# EAGLE design with_usb_small_smd_jmp (EAGLE 8.3.2)
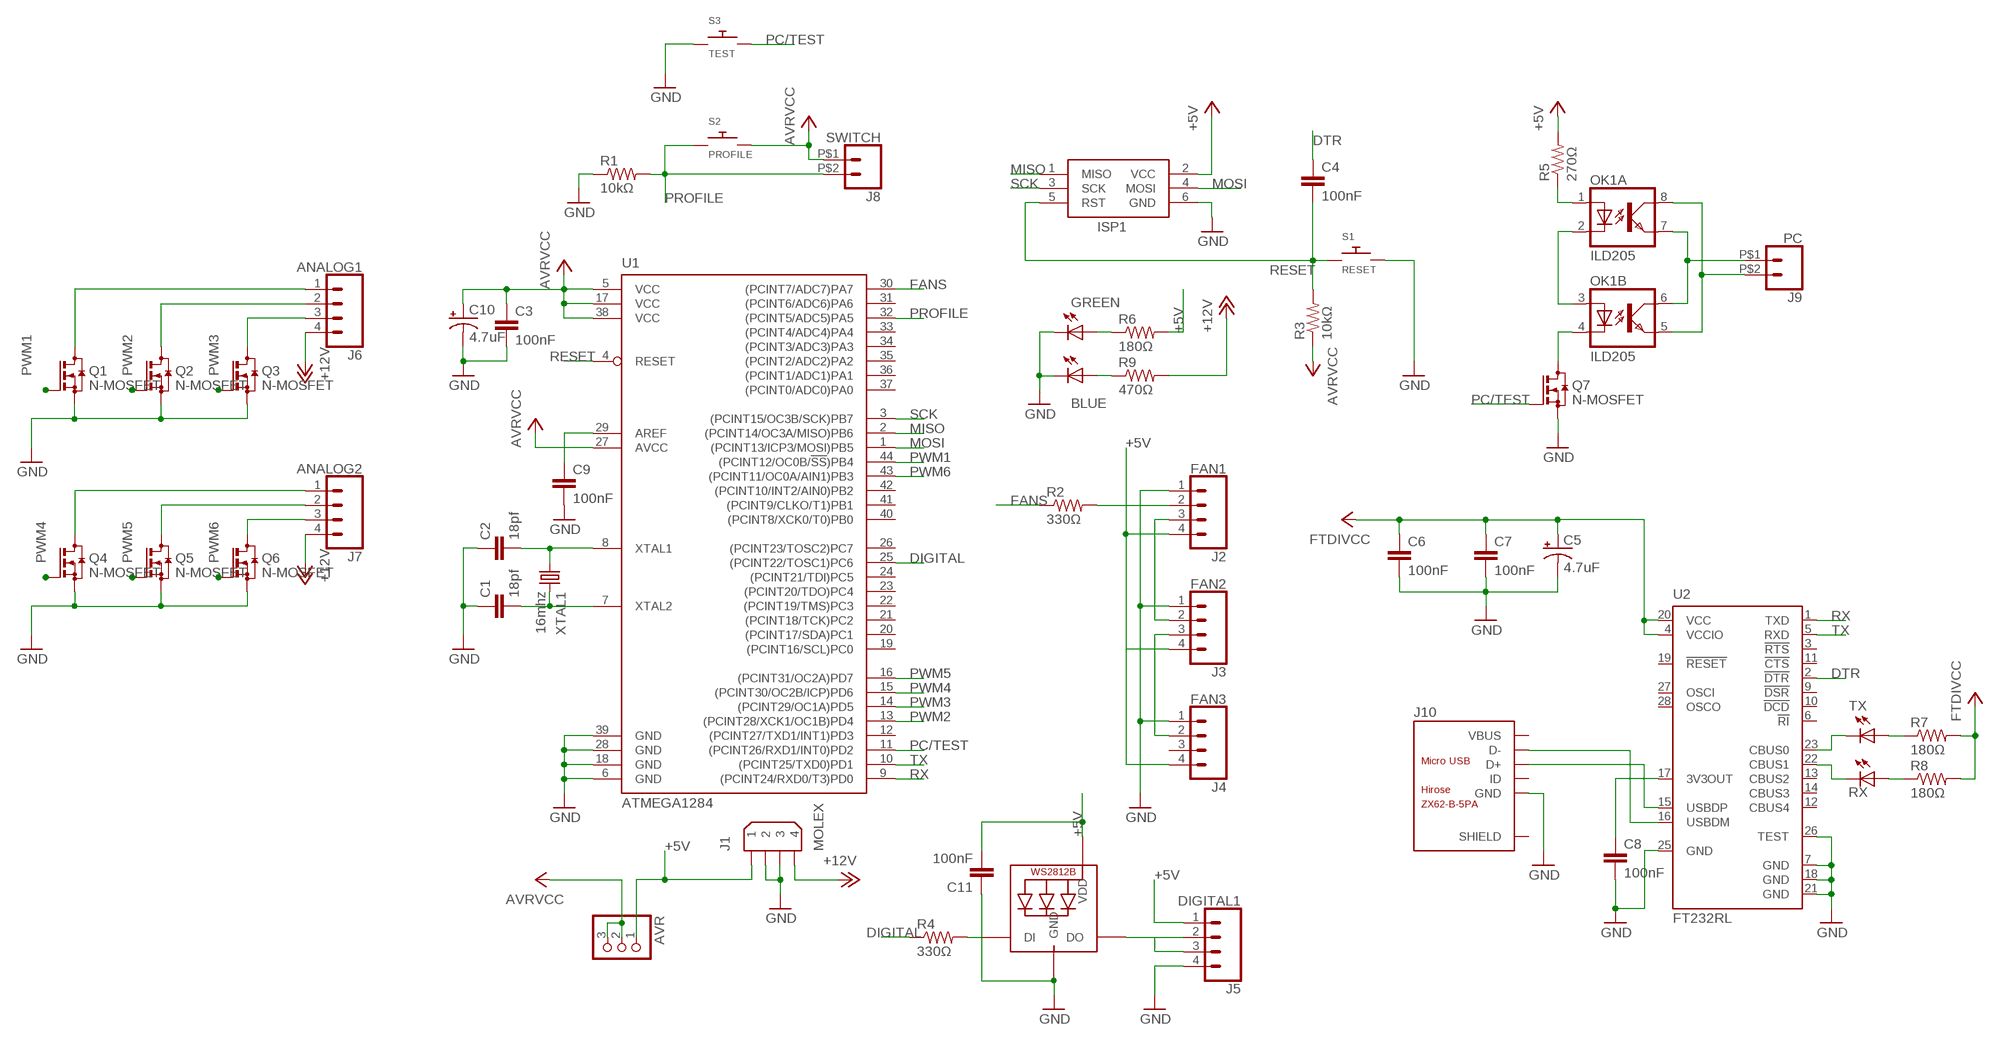
[diagram p0: schematic, sheet 1]

## Parts
AVR  PINHD-1X3  [1X03]
C1  18pf  C-EUC0805  [C0805]
C2  18pf  C-EUC0805  [C0805]
C3  100nF  C-EUC0805  [C0805]
C4  100nF  C-EUC0805  [C0805]
C5  4.7uF  CPOL-US153CLV-0405  [153CLV-0405]
C6  100nF  C-EUC0805  [C0805]
C7  100nF  C-EUC0805  [C0805]
C8  100nF  C-EUC0805  [C0805]
C9  100nF  C-EUC0805  [C0805]
C10  4.7uF  CPOL-US153CLV-0405  [153CLV-0405]
C11  100nF  C-EUC0805  [C0805]
ISP1  AVRISP-6  [AVRISP]
J1  MOLEX  9090-4R  [9090-4R]
J2  FAN1  TJC8-4P  [TJC8-4P]
J3  FAN2  TJC8-4P  [TJC8-4P]
J4  FAN3  TJC8-4P  [TJC8-4P]
J5  DIGITAL1  MX-22-05-3041  [MX-22-05-3041]
J6  ANALOG1  MX-22-05-3041  [MX-22-05-3041]
J7  ANALOG2  MX-22-05-3041  [MX-22-05-3041]
J8  SWITCH  MX-7395-02BG  [MX-7395-02BG]
J9  PC  MX-7395-02BG  [MX-7395-02BG]
J10  MICRO_USB  [MICRO_USB]
LED1  TX  LEDSML0805  [SML0805]
LED2  RX  LEDSML0805  [SML0805]
LED3  GREEN  LEDSML0805  [SML0805]
LED4  BLUE  LEDSML0805  [SML0805]
OK1  ILD205  [SOIC08]
Q1  N-MOSFET  [SOT23]
Q2  N-MOSFET  [SOT23]
Q3  N-MOSFET  [SOT23]
Q4  N-MOSFET  [SOT23]
Q5  N-MOSFET  [SOT23]
Q6  N-MOSFET  [SOT23]
Q7  N-MOSFET  [SOT23]
R1  10kΩ  R-US_R0805  [R0805]
R2  330Ω  R-US_R0805  [R0805]
R3  10kΩ  R-US_R0805  [R0805]
R4  330Ω  R-US_R0805  [R0805]
R5  270Ω  R-US_R0805  [R0805]
R6  180Ω  R-US_R0805  [R0805]
R7  180Ω  R-US_R0805  [R0805]
R8  180Ω  R-US_R0805  [R0805]
R9  470Ω  R-US_R0805  [R0805]
RGB  WS2812B  [WS2812B]
S1  RESET  BUTTON  [B3F-1000]
S2  PROFILE  BUTTON  [B3F-1000]
S3  TEST  BUTTON  [B3F-1000]
U1  ATMEGA1284  ATMEGA1284P-AU  [TQFP44]
U2  FT232RL  [SSOP28]
XTAL1  16mhz  CRYSTALHC49U-V  [HC49U-V]

## Nets
+3V3: C8.1 U2.17(3V3OUT)
+5V: AVR.1 C5.+ C6.1 C7.1 C11.2 J1.1 J2.4 J3.4 J4.4 J5.1 R5.2 R6.2 R7.2 R8.2 RGB.1-VDD(VDD) U2.4(VCCIO) U2.20(VCC) ; supply symbol labelled FTDIVCC
+12V: J1.4 J6.4 J7.4 R9.2
AVR: AVR.2 AVR.3 C3.1 C10.+ ISP1.2(VCC) J8.P$1 R3.1 S2.3 S2.4 U1.5(VCC) U1.17(VCC) U1.27(AVCC) U1.38(VCC) ; supply symbol labelled AVRVCC, +5V
D+: J10.3(D+) U2.15(USBDP)
D-: J10.2(D-) U2.16(USBDM)
DIGITAL: R4.1 U1.25((PCINT22/TOSC1)PC6)
DIN-D: J5.2 J5.3 RGB.2-DOUT(DO)
DTR: C4.1 U2.2(!DTR)
F1-DIN: J2.2 R2.2
F2-DIN: J2.3 J3.2
F3-DIN: J3.3 J4.2
FANS: R2.1 U1.30((PCINT7/ADC7)PA7)
GND: C1.1 C2.1 C3.2 C5.- C6.2 C7.2 C8.2 C9.2 C10.- C11.1 ISP1.6(GND) J1.2 J1.3 J2.1 J3.1 J4.1 J5.4 J10.5(GND) LED3.C LED4.C Q1.2(S) Q2.2(S) Q3.2(S) Q4.2(S) Q5.2(S) Q6.2(S) Q7.2(S) R1.1 RGB.3-GND(GND) S1.3 S1.4 S3.1 S3.2 U1.6(GND) U1.18(GND) U1.28(GND) U1.39(GND) U2.7(GND) U2.18(GND) U2.21(GND) U2.25(GND) U2.26(TEST)
LED-IN: R4.2 RGB.4-DIN(DI)
MISO: ISP1.1(MISO) U1.2((PCINT14/OC3A/MISO)PB6)
MOSI: ISP1.4(MOSI) U1.1((PCINT13/ICP3/MOSI)PB5)
N$2: LED1.A R7.1
N$4: LED2.A R8.1
N$5: LED4.A R9.1
N$6: C9.1 U1.29(AREF)
N$7: LED3.A R6.1
N$8: OK1.1(A:A) R5.1
N$11: OK1.2(A:C) OK1.3(B:A)
N$13: OK1.4(B:C) Q7.3(D)
PC1: J9.P$2 OK1.5(B:EMIT) OK1.8(A:COL)
PC2: J9.P$1 OK1.6(B:COL) OK1.7(A:EMIT)
PC/TEST: Q7.1(G) S3.3 S3.4 U1.11((PCINT26/RXD1/INT0)PD2)
PROFILE: J8.P$2 R1.2 S2.1 S2.2 U1.32((PCINT5/ADC5)PA5)
PWM1: Q1.1(G) U1.44((PCINT12/OC0B/!SS!)PB4)
PWM2: Q2.1(G) U1.13((PCINT28/XCK1/OC1B)PD4)
PWM3: Q3.1(G) U1.14((PCINT29/OC1A)PD5)
PWM4: Q4.1(G) U1.15((PCINT30/OC2B/ICP)PD6)
PWM5: Q5.1(G) U1.16((PCINT31/OC2A)PD7)
PWM6: Q6.1(G) U1.43((PCINT11/OC0A/AIN1)PB3)
RESET: C4.2 ISP1.5(RST) R3.2 S1.1 S1.2 U1.4(RESET)
RX: U1.9((PCINT24/RXD0/T3)PD0) U2.1(TXD)
RXLED: LED2.C U2.22(CBUS1)
S1-1: J6.1 Q1.3(D)
S1-2: J6.2 Q2.3(D)
S1-3: J6.3 Q3.3(D)
S2-1: J7.1 Q4.3(D)
S2-2: J7.2 Q5.3(D)
S2-3: J7.3 Q6.3(D)
SCK: ISP1.3(SCK) U1.3((PCINT15/OC3B/SCK)PB7)
TX: U1.10((PCINT25/TXD0)PD1) U2.5(RXD)
TXLED: LED1.C U2.23(CBUS0)
XTAL1: C2.2 U1.8(XTAL1) XTAL1.1
XTAL2: C1.2 U1.7(XTAL2) XTAL1.2
Unconnected: J4.3 J10.1(VBUS) J10.4(ID) J10.S1(SHIELD) J10.S2(SHIELD) J10.S3(SHIELD) J10.S4(SHIELD) J10.S5(SHIELD) J10.S6(SHIELD) U1.12((PCINT27/TXD1/INT1)PD3) U1.19((PCINT16/SCL)PC0) U1.20((PCINT17/SDA)PC1) U1.21((PCINT18/TCK)PC2) U1.22((PCINT19/TMS)PC3) U1.23((PCINT20/TDO)PC4) U1.24((PCINT21/TDI)PC5) U1.26((PCINT23/TOSC2)PC7) U1.31((PCINT6/ADC6)PA6) U1.33((PCINT4/ADC4)PA4) U1.34((PCINT3/ADC3)PA3) U1.35((PCINT2/ADC2)PA2) U1.36((PCINT1/ADC1)PA1) U1.37((PCINT0/ADC0)PA0) U1.40((PCINT8/XCK0/T0)PB0) U1.41((PCINT9/CLKO/T1)PB1) U1.42((PCINT10/INT2/AIN0)PB2) U2.3(!RTS) U2.6(!RI) U2.9(!DSR) U2.10(!DCD) U2.11(!CTS) U2.12(CBUS4) U2.13(CBUS2) U2.14(CBUS3) U2.19(!RESET) U2.27(OSCI) U2.28(OSCO)

## Library data of the parts
AVR = my_parts:PINHD-1X3: PIN HEADER
C1 C4 = rcl:C-EU: CAPACITOR, European symbol
C2 C3 C6-C9 C11 = resistor:C-EU: CAPACITOR, European symbol
C5 C10 = resistor:CPOL-US: POLARIZED CAPACITOR, American symbol
ISP1 = my_parts:AVRISP: AVR ISP HEADER Standard 6 pin header for AVR programming
J1 = con-thomas-betts:9090-4: Disk Drive Power four position Source: Thomas & Betts Electronic Interconnects Eiropean Edition 1998; OC_FARNELL: unknown; OC_NEWARK: unknown
J2-J4 = my_parts:TJC8-4P
J5-J7 = my_parts:MX-22-05-3041
J8 J9 = my_parts:MX-7395-02BG
J10 = my_parts:MICRO_USB
LED1-LED4 = led:LED: LED OSRAM: - CHIPLED LG R971, LG N971, LY N971, LG Q971, LY Q971, LO R971, LY R971 LH N974, LH R974 LS Q976, LO Q976, LY Q976 LO Q996 - Hyper CHIPLED LW Q18S LB Q993, LB Q99A, LB R99A - SideLED LS A670, LO A670, LY A670, LG A670, LP A670 LB A673, LV A673, LT A673, LW A673 LH A674 LY A675 LS A676, LA A676, LO A676, LY A676, LW A676 LS A679, LY A679, LG A679 - Hyper Micro SIDELED® LS Y876, LA Y876, LO Y876, LY Y876 LT Y87S - SmartLED LW L88C, LW L88S LB L89C, LB L89S, LG L890 LS L89K, LO L89K, LY L89K LS L896, LA L896, LO L896, LY L896 - TOPLED LS T670, LO T670, LY T670, LG T670, LP T670 LSG T670, LSP T670, LSY T670, LOP T670, LYG T670 LG T671, LOG T671, LSG T671 LB T673, LV T673, LT T673, LW T673 LH T674 LS T676, LA T676, LO T676, LY T676, LB T676, LH T676, LSB T676, LW T676 LB T67C, LV T67C, LT T67C, LS T67K, LO T67K, LY T67K, LW E67C LS E67B, LA E67B, LO E67B, LY E67B, LB E67C, LV E67C, LT E67C LW T67C LS T679, LY T679, LG T679 LS T770, LO T770, LY T770, LG T770, LP T770 LB T773, LV T773, LT T773, LW T773 LH T774 LS E675, LA E675, LY E675, LS T675 LS T776, LA T776, LO T776, LY T776, LB T776 LHGB T686 LT T68C, LB T68C - Hyper Mini TOPLED® LB M676 - Mini TOPLED Santana® LG M470 LS M47K, LO M47K, LY M47K Source: http://www.osram.convergy.de LUXEON: - LUMILED® LXK2-PW12-R00, LXK2-PW12-S00, LXK2-PW14-U00, LXK2-PW14-V00 LXK2-PM12-R00, LXK2-PM12-S00, LXK2-PM14-U00 LXK2-PE12-Q00, LXK2-PE12-R00, LXK2-PE12-S00, LXK2-PE14-T00, LXK2-PE14-U00 LXK2-PB12-K00, LXK2-PB12-L00, LXK2-PB12-M00, LXK2-PB14-N00, LXK2-PB14-P00, LXK2-PB14-Q00 LXK2-PR12-L00, LXK2-PR12-M00, LXK2-PR14-Q00, LXK2-PR14-R00 LXK2-PD12-Q00, LXK2-PD12-R00, LXK2-PD12-S00 LXK2-PH12-R00, LXK2-PH12-S00 LXK2-PL12-P00, LXK2-PL12-Q00, LXK2-PL12-R00 Source: www.luxeon.com KINGBRIGHT: KA-3528ASYC Source: www.kingbright.com
OK1 = optocoupler:ILD2*: Siemens ILD205/206/207/211/213/217 DUAL PHOTOTRANSISTOR SMALL OUTLINE SURFACE MOUNT OPTOCOUPLER Source: 153385-da-01-en-Optocoupler_ILD205-T.pdf; MF: VISHAY/TELEFUNKEN; MPN: ILD205T; OC_FARNELL: 1469512; OC_NEWARK: 20H8678
Q1-Q7 = my_parts:N-MOSFET
R1-R9 = resistor:R-US_: RESISTOR, American symbol
RGB = my_parts:WS2812B
S1-S3 = my_parts:BUTTON
U1 = my_parts:ATMEGA1284P-AU
U2 = ftdichip:FT232R: Source: http://www.ftdichip.com/Documents/DataSheets/DS_FT232R_v104.pdf; MPN: FT232RL; OC_FARNELL: 1146032; OC_NEWARK: 91K9918
XTAL1 = adafruit:CRYSTAL: CRYSTAL; OC_FARNELL: 1666969; OC_NEWARK: unknown

## Net classes
0 default: clearance 0.152 mm
1 GND: clearance 0.61 mm

## Board
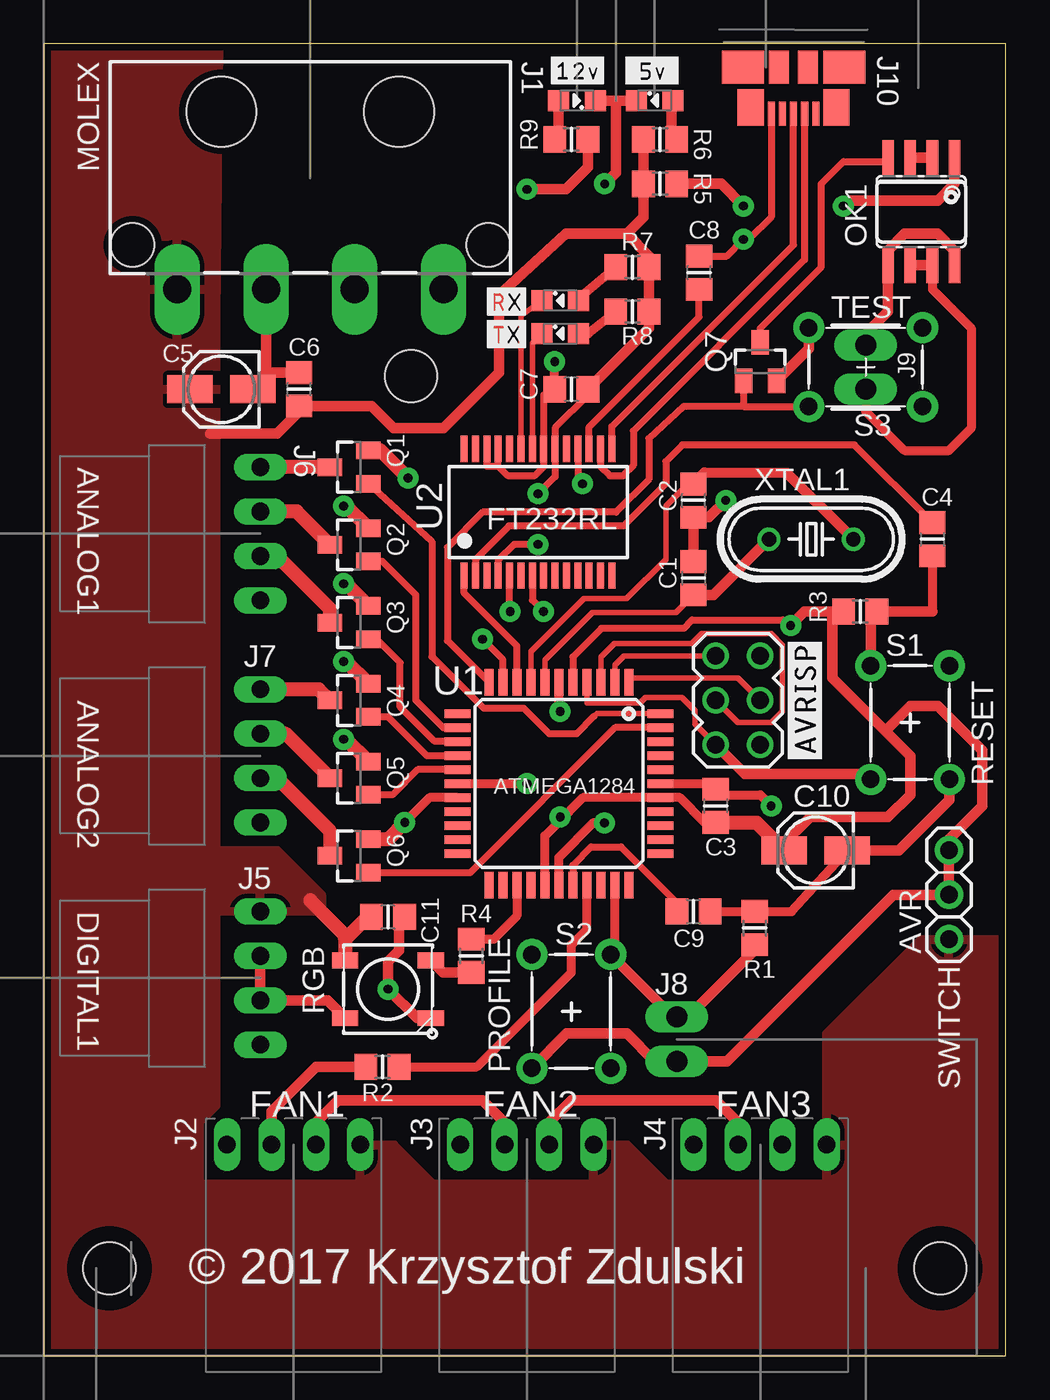
[diagram p1: board, top side]
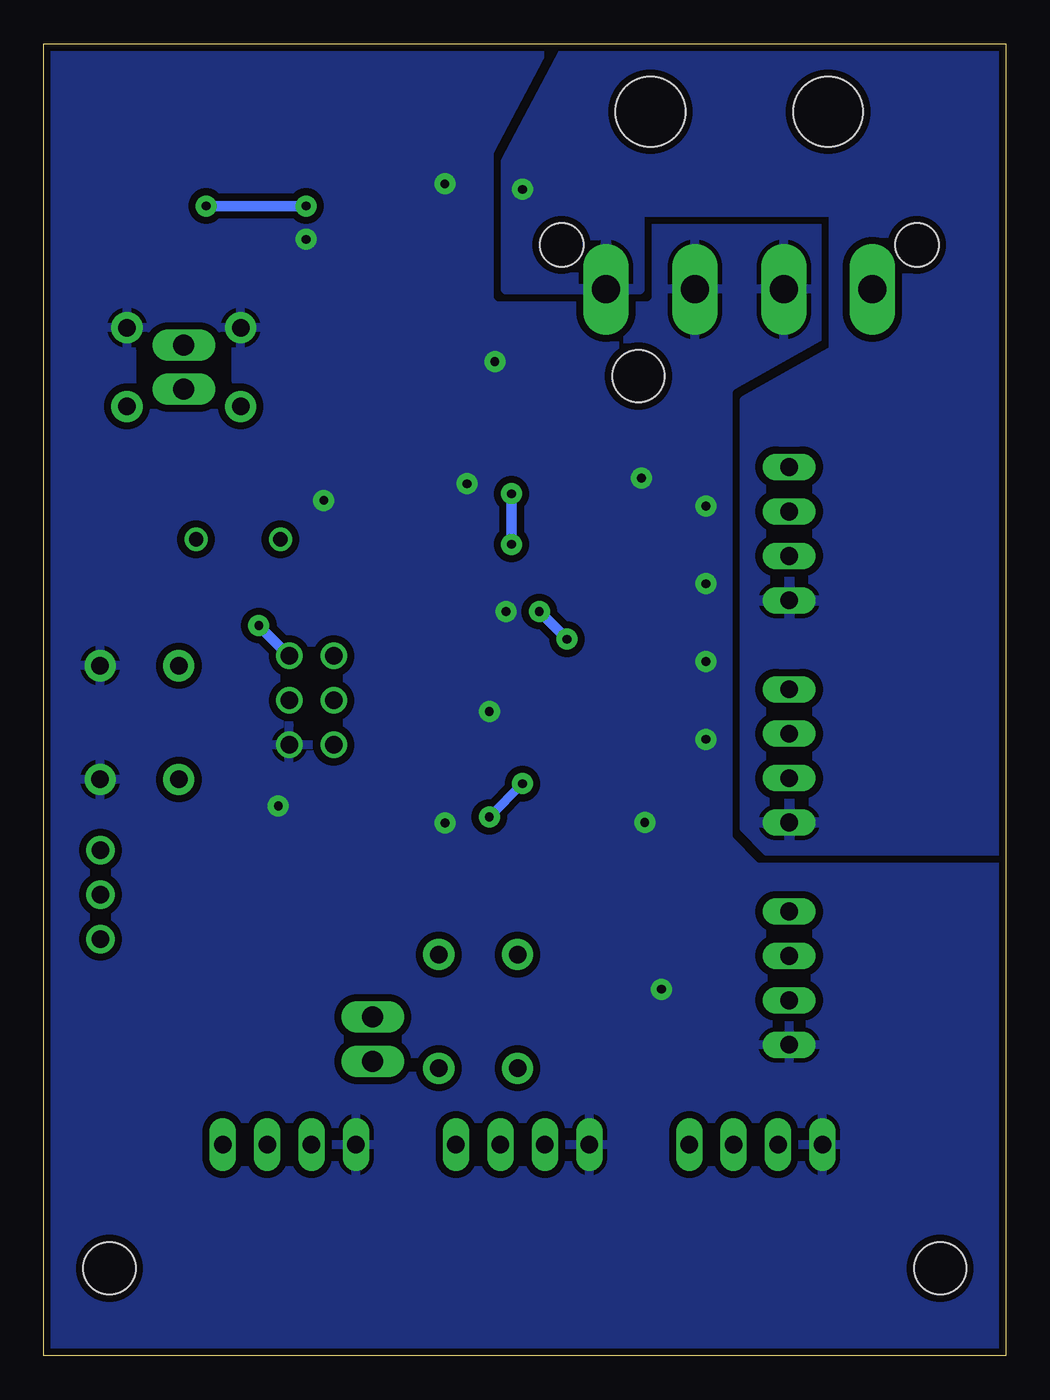
[diagram p2: board, bottom side, seen from below]

Size 55 x 75 mm. Coordinates in mm from the lower left corner, seen from the top.
Outline: 0,0 55,0 55,75 0,75 0,0
Copper layers (1*16): Top 0.035mm / dielectric 1.5mm / Bottom 0.035mm
Design rules "default *": minimum track width 6mil, minimum drill 0.35mm, track to track 6mil, track to pad 6mil, pad to pad 6mil, via to via 6mil, smd to smd 6mil, copper to edge 10mil, drill to drill 6mil, minimum pad ring 10mil, minimum via ring 8mil, stop-mask expansion 2mil, vias tented up to drill 20mil, thermal gap 10mil
Holes 3 mm at 51.25,5 3.75,5 21,56
tRestrict: area 2,3.2 to 5.5,6.8; area 49.5,3.2 to 53,6.8
bRestrict: area 48.9,55.4 to 49.2,57.6; area 44.8,55.6 to 45.1,57.8

### Footprints (pad centres in the part's own frame; a part is rotated, then mirrored left to right if it is on the bottom)
1X03 = drill 1 pad 1.626: 1 -2.54,0; 2 0,0; 3 2.54,0
C0805 = smd 1.3 x 1.5: 1 -0.95,0; 2 0.95,0
153CLV-0405 = smd 2.6 x 1.6: + 1.8,0; - -1.8,0
AVRISP = drill 1 pad 1.524: 1 -1.27,2.54; 2 1.27,2.54; 3 -1.27,0; 4 1.27,0; 5 -1.27,-2.54; 6 1.27,-2.54
9090-4R = drill 1.6 pad 2.6 long: 1 -7.62,-6.35; 2 -2.54,-6.35; 3 2.54,-6.35; 4 7.62,-6.35 | hole 4: -5.08,3.81; 5.08,3.81 | hole 2.5: -10.16,-3.81; 10.16,-3.81
TJC8-4P = drill 1 long: 1 3.81,0; 2 1.27,0; 3 -1.27,0; 4 -3.81,0
MX-22-05-3041 = drill 1.016 long: 1 3.81,0; 2 1.27,0; 3 -1.27,0; 4 -3.81,0
MX-7395-02BG = drill 1.2 long: P$1 -1.27,0; P$2 1.27,0
MICRO_USB = smd 0.406 x 1.38: 1 1.27,-2.667; 2 0.635,-2.667; 3 0,-2.667; 4 -0.635,-2.667; 5 -1.27,-2.667 | smd 1.5 x 2.1: S1 -2.45,-2.3; S2 2.45,-2.3 | smd 2.4 x 1.9: S3 -2.9,0; S4 2.9,0 | smd 1.15 x 1.9: S5 -0.825,0; S6 0.825,0
SML0805 = smd 1.2 x 1.2: A 1.05,0; C -1.05,0
SOIC08 = smd 0.66 x 2.032: 1 -1.905,-3.073; 2 -0.635,-3.073; 3 0.635,-3.073; 4 1.905,-3.073; 5 1.905,3.073; 6 0.635,3.073; 7 -0.635,3.073; 8 -1.905,3.073
SOT23 = smd 1 x 1.4: 1 -0.95,-1.1; 2 0.95,-1.1; 3 0,1.1
R0805 = smd 1.3 x 1.5: 1 -0.95,0; 2 0.95,0
WS2812B = smd 1.5 x 0.9: 1-VDD 2.45,-1.65; 2-DOUT 2.45,1.65; 3-GND -2.45,1.65; 4-DIN -2.45,-1.65
B3F-1000 = drill 1 pad 1.778: 1 -3.25,2.25; 2 3.25,2.25; 3 -3.25,-2.25; 4 3.25,-2.25
TQFP44 = smd 1.5 x 0.5: 1 -5.8,4; 2 -5.8,3.2; 3 -5.8,2.4; 4 -5.8,1.6; 5 -5.8,0.8; 6 -5.8,0; 7 -5.8,-0.8; 8 -5.8,-1.6; 9 -5.8,-2.4; 10 -5.8,-3.2; 11 -5.8,-4; 23 5.8,-4; 24 5.8,-3.2; 25 5.8,-2.4; 26 5.8,-1.6; 27 5.8,-0.8; 28 5.8,0; 29 5.8,0.8; 30 5.8,1.6; 31 5.8,2.4; 32 5.8,3.2; 33 5.8,4 | smd 0.5 x 1.5: 12 -4,-5.8; 13 -3.2,-5.8; 14 -2.4,-5.8; 15 -1.6,-5.8; 16 -0.8,-5.8; 17 0,-5.8; 18 0.8,-5.8; 19 1.6,-5.8; 20 2.4,-5.8; 21 3.2,-5.8; 22 4,-5.8; 34 4,5.8; 35 3.2,5.8; 36 2.4,5.8; 37 1.6,5.8; 38 0.8,5.8; 39 0,5.8; 40 -0.8,5.8; 41 -1.6,5.8; 42 -2.4,5.8; 43 -3.2,5.8; 44 -4,5.8
SSOP28 = smd 0.4 x 1.5: 1 -4.225,-3.625; 2 -3.575,-3.625; 3 -2.925,-3.625; 4 -2.275,-3.625; 5 -1.625,-3.625; 6 -0.975,-3.625; 7 -0.325,-3.625; 8 0.325,-3.625; 9 0.975,-3.625; 10 1.625,-3.625; 11 2.275,-3.625; 12 2.925,-3.625; 13 3.575,-3.625; 14 4.225,-3.625; 15 4.225,3.625; 16 3.575,3.625; 17 2.925,3.625; 18 2.275,3.625; 19 1.625,3.625; 20 0.975,3.625; 21 0.325,3.625; 22 -0.325,3.625; 23 -0.975,3.625; 24 -1.625,3.625; 25 -2.275,3.625; 26 -2.925,3.625; 27 -3.575,3.625; 28 -4.225,3.625
HC49U-V = drill 0.813: 1 -2.413,0; 2 2.413,0

### Placement (x,y rotation side)
AVR  51.75,26.35 90 top
C1  37.15,44.45 270 top
C2  37.15,48.88 90 top
C3  38.42,31.43 90 top
C4  50.8,46.67 270 top
C5  10.16,55.24 180 top
C6  14.61,55.24 90 top
C7  30.16,55.24 180 top
C8  37.47,61.91 90 top
C9  37.15,25.4 0 top
C10  44.13,28.89 180 top
C11  19.68,25.08 180 top
ISP1  39.69,37.47 0 top
J1  15.24,67.31 0 top
J2  14.29,12.06 180 top
J3  27.62,12.06 180 top
J4  40.96,12.06 180 top
J5  12.38,21.59 90 top
J6  12.38,46.99 90 top
J7  12.38,34.29 90 top
J8  36.2,18.1 90 top
J9  46.99,56.52 90 top
J10  42.86,73.66 0 top
LED1  29.53,60.33 0 top
LED2  29.53,58.42 0 top
LED3  34.92,71.75 0 top
LED4  30.48,71.75 180 top
OK1  50.16,65.41 180 top
Q1  17.46,50.8 90 top
Q2  17.46,46.35 90 top
Q3  17.46,41.91 90 top
Q4  17.46,37.47 90 top
Q5  17.46,33.02 90 top
Q6  17.46,28.57 90 top
Q7  40.96,56.83 0 top
R1  40.64,24.45 270 top
R2  19.37,16.52 180 top
R3  46.67,42.55 0 top
R4  24.45,22.86 270 top
R5  35.24,66.99 180 top
R6  35.24,69.53 180 top
R7  33.66,62.23 0 top
R8  33.66,59.69 0 top
R9  30.16,69.53 0 top
RGB  19.68,20.95 180 top
S1  49.53,36.2 90 top
S2  30.16,19.68 270 top
S3  46.99,56.52 0 top
U1  29.45,32.7 270 top
U2  28.26,48.22 0 top
XTAL1  43.88,46.67 180 top

### Tracks (layer width: path | path; a pad name or v marks a point on that pad's centre or on a via)
+3V3
  Top 0.406: U2.17 31.18,53.09 37.47,59.37 C8.1
+5V  (via drill 0.5 pad 1.2)
  Top 0.406: U2.4 25.98,45.47 26.89,46.38 v28.26,46.38 | v28.26,49.27 29.23,50.25 U2.20 29.23,53.05 31.11,54.93 31.11,55.56 C7.1
  Top 0.61: v28.26,49.27 28.2,49.21 | C6.1 | C6.1 14.61,53.98 13.34,52.7 9.53,52.7 | 33.34,64.14 29.84,64.14 26.04,60.64 26.04,56.2 22.86,53.02 20,53.02 18.73,54.3 18.73,54.29 C6.1 | 33.34,64.14 34.6,62.87 R7.2 R8.2 34.6,58.74 C7.1 | 33.34,64.14 34.29,65.09 R5.2 R6.2
  Top 0.813: 17.23,23.81 RGB.1-VDD | 17.23,23.81 17.23,24.04 15.24,26.04 | C11.2 18.66,25.24 17.23,23.81
  Bottom 0.61: v28.26,49.27 v28.26,46.38
  pour Top (isolate 0.406): 0,0 0,75 10,75 9.84,59.37 9.84,28.89 13.34,28.89 15.88,26.35 15.88,25.4 9.84,25.4 9.84,14.29 8.89,13.34 8.89,9.84 18.1,9.84 18.1,12.06 20,12.06 22.23,9.84 31.43,9.84 31.43,12.06 33.34,12.06 35.56,9.84 44.77,9.84 44.77,18.41 50.16,23.81 54.93,23.81 55,0
+12V  (via drill 0.5 pad 1.2)
  Top 0.61: R9.2 31.11,67.94 29.84,66.67 v27.62,66.67
  pour Bottom (isolate 0.406): 0,28.89 13.65,28.89 14.92,30.16 14.92,54.61 9.84,57.47 9.84,65.41 20.95,65.41 20.95,60.96 28.57,60.96 28.57,68.26 25,75 0,75
AVR  (via drill 0.5 pad 1.2)
  Top 0.406: v42.7,41.75 42.23,42.06 37.07,42.06 36.59,41.58 31.88,41.58 30.25,39.95 U1.5 | 28.7,26.95 U1.27
  Top 0.508: U1.27 28.65,29.71 29.31,30.38 | 29.31,30.38 30.84,31.9 U1.38 36.36,31.9 37.78,30.48 C3.1 | U1.17 v27.62,32.7 | v29.53,30.8 29.31,30.38 | 42.12,29.1 C10.+
  Top 0.61: S2.4 29.89,18.41 33.34,18.41 34.92,16.83 J8.P$1 39.05,16.83 48.58,26.35 AVR.2 AVR.3 51.75,29.53 53.66,31.43 53.66,34.61 51.12,37.15 49.53,37.15 48.1,35.72 | v42.7,41.75 43.5,42.55 R3.1 45.09,42.55 45.09,38.73 48.1,35.72 | 48.1,35.72 49.53,34.29 49.53,32.07 48.26,30.8 43.81,30.8 42.12,29.1
  Top 0.813: C10.+ 42.55,28.68 | C3.1 40.75,30.48 42.12,29.1
  Bottom 0.508: v27.62,32.7 v29.53,30.8
  Bottom 0.61: v42.7,41.75 ISP1.2
D+
  Top 0.406: U2.15 32.48,53.12 42.86,63.5 J10.3
D-
  Top 0.406: U2.16 31.83,50.83 32.36,50.3 33.12,50.3 33.71,50.9 33.71,52.86 43.5,62.65 J10.2
DIGITAL
  Top 0.508: U1.25 27.05,25.14 25.72,23.81 R4.1
DIN-D
  Top 0.61: J5.2 J5.3 16.22,20.32 RGB.2-DOUT
DTR
  Top 0.406: U2.2 24.68,45.53 26.59,47.43 33.14,47.43 35.56,49.85 35.56,51.12 36.51,52.07 46.35,52.07 C4.1
F1-DIN
  Top 0.61: R2.2 15.56,16.52 13.02,13.97 J2.2
F2-DIN
  Top 0.61: J2.3 15.56,13.34 16.83,14.61 25.08,14.61 26.35,13.34 J3.2
F3-DIN
  Top 0.61: J3.3 28.89,13.34 30.16,14.61 38.42,14.61 39.69,13.34 J4.2
FANS
  Top 0.508: R2.1 24.77,16.52 30.16,21.91 30.16,23.5 31.05,24.38 U1.30
GND  (via drill 0.5 pad 1.2)
  Top 0.406: U2.7 27.93,43.19 v28.57,42.55 | 25.98,50.85 26.51,50.32 28.1,50.32 28.58,50.81 U2.21 28.58,54.93 C7.2 | 25.98,50.85 U2.25 | U2.26 25.33,50.85 25.98,50.85 | U2.18 30.53,50.11 v30.8,49.85 | J10.5 41.59,65.09 40.32,63.82 v40.01,63.82 39.05,62.86 C8.2
  Top 0.508: U1.6 29.45,36.91 v29.53,36.83 | U1.28 29.45,28.48 31.43,30.48 v32.06,30.45 | U1.18 22.06,31.9 v20.64,30.48 | C9.2 R1.1 42.76,25.4 C10.- | U1.39 38.1,32.7 C3.2 38.73,32.07 38.74,32.06 40.96,32.06 v41.59,31.43 | C7.2 v29.21,56.83
  Top 0.61: 32.7,71.75 32.7,67.63 v32.07,66.99 | C1.1 C2.1 38.03,47.93 v38.99,48.9 | 32.7,71.75 LED4.C | 32.7,71.75 LED3.C | RGB.3-GND 21.34,19.3 v19.68,20.95 19.68,22.54 20.32,23.18 20.32,24.61 C11.1 | Q7.2 43.74,57.56 S3.1 | C6.2 12.91,56.2 C5.- 12.7,55.24 J1.2 | C10.- 48.9,28.89 51.78,31.78 S1.3
  Top 0.813: 18.41,29.53 Q6.2 19.68,29.52 v20.64,30.48 | Q5.2 17.29,35.24 v17.14,35.24 | Q4.2 17.29,39.69 v17.14,39.69 | Q3.2 17.29,44.13 v17.14,44.13 | Q2.2 17.29,48.58 v17.14,48.58 | Q1.2 19.25,51.75 v20.82,50.17
  Top 1.016: 18.73,42.86 Q3.2
  pour Bottom (isolate 0.406, rank 2): 0,75 55,75 55,0 0,0
LED-IN
  Top 0.61: R4.2 22.83,21.91 RGB.4-DIN
MISO
  Top 0.305: U1.2 32.65,39.49 33.16,40 38.26,40 ISP1.1
MOSI
  Top 0.305: ISP1.4 39.68,38.74 33.63,38.74 U1.1
N$1
  pour Bottom (rank 2): 11.15,9.53 40.64,9.53 40.32,0.71 11.11,1.03
N$2
  Top 0.508: R7.1 30.58,60.42 LED1.A
N$4
  Top 0.508: R8.1 31.12,58.42 LED2.A
N$5
  Top 0.61: 29.21,71.54 LED4.A 29.43,69.75 R9.1
N$6
  Top 0.406: U1.29 30.25,28.04 31.3,29.09 33.01,29.09 36.55,25.54 C9.1
N$7
  Top 0.61: LED3.A 35.88,71.66 35.88,69.85 R6.1
N$8  (via drill 0.5 pad 1.2)
  Top 0.61: R5.1 38.73,67 v40.01,65.72 | v45.72,65.72 46.04,66.04 51.12,66.04 52.07,66.99 OK1.1
  Bottom 0.61: v40.01,65.72 v45.72,65.72
N$11
  Top 0.61: OK1.3 OK1.2
N$13
  Top 0.406: Q7.3 40.96,58.74 44.45,62.23 44.45,66.99 45.72,68.26 48.04,68.26 OK1.4
PC1
  Top 0.61: OK1.8 52.07,63.18 51.12,64.14 49.21,64.14 48.26,63.18 OK1.5 48.26,59.69 46.99,58.42 J9.P$2
PC2
  Top 0.508: J9.P$1 46.99,53.98 49.21,51.75 51.75,51.75 53.02,53.02 53.02,58.74 50.8,60.96 OK1.7
  Top 0.61: OK1.6 OK1.7
PC/TEST
  Top 0.406: S3.3 42.98,54.27 40.01,54.27 | 40.01,54.27 36.59,54.27 34.59,52.43 34.59,50.09 32.72,48.23 25.1,48.23 23.08,46.21 23.08,40.88 U1.11 | Q7.1 40.01,54.27
PROFILE
  Top 0.508: S2.1 32.65,23.33 U1.32
  Top 0.61: R1.2 40.64,23.18 36.83,19.37 J8.P$2 35.66,19.68 S2.1
PWM1
  Top 0.305: 31.46,36.56 31.62,36.7 U1.44
  Top 0.406: 31.46,36.56 30.48,35.56 28.89,35.56 27.43,37.02 25.15,37.02 22.2,39.97 22.2,46.53 Q1.1
PWM2
  Top 0.406: 23.62,35.88 U1.13 22.84,35.9 21.27,37.47 21.27,43.5 19.36,45.41 Q2.1
PWM3
  Top 0.406: Q3.1 19.2,40.81 20.38,39.62 20.38,37.08 22.35,35.12 23.64,35.12 U1.14
PWM4
  Top 0.406: U1.15 23.64,34.29 21.91,34.29 19.68,36.52 Q4.1
PWM5
  Top 0.406: 23.61,33.47 U1.16 21.37,33.5 19.94,32.07 Q5.1
PWM6
  Top 0.406: Q6.1 24.39,27.62 32.67,35.9 U1.43
RESET
  Top 0.305: ISP1.5 37.24,36.11 37.24,36.88 36.47,37.64 34.41,37.64 34.09,37.33 31.05,37.33 U1.4
  Top 0.508: C4.2 50.8,42.55
  Top 0.61: 50.8,42.55 R3.2 47.28,42.25 S1.2 | ISP1.5 40.08,33.26 46.96,33.26 S1.1
RX
  Top 0.406: U2.1 24.03,43.59 27.05,40.58 U1.9
RXLED
  Top 0.305: LED2.C 27.93,57.88 U2.22
S1-1
  Top 0.813: Q1.3 J6.1
S1-2
  Top 0.813: Q2.3 14.46,48.26 J6.2
S1-3
  Top 0.813: Q3.3 16.36,42.69 13.34,45.72 J6.3
S2-1
  Top 0.813: Q4.3 15.73,38.1 J7.1
S2-2
  Top 0.813: Q5.3 13.82,35.56 J7.2
S2-3
  Top 0.813: J7.3 13.34,33.02 16.36,29.99 Q6.3
SCK
  Top 0.305: ISP1.3 39.69,36.2 41.59,36.2 42.23,36.83 42.23,40.64 41.59,41.27 37.62,41.27 37.05,40.71 32.63,40.71 31.85,39.93 U1.3
TX  (via drill 0.5 pad 1.2)
  Top 0.406: U1.10 26.25,39.79 v25.08,40.96 | v26.67,42.55 26.63,42.58 U2.5
  Bottom 0.61: v25.08,40.96 v26.67,42.55
TXLED
  Top 0.305: LED1.C 27.28,59.45 U2.23
XTAL1
  Top 0.305: U1.8 27.85,40.24 30.88,43.27 33.31,43.27 35.56,45.53 35.56,48.58 36.81,49.83 C2.2
  Top 0.61: C2.2 37.15,49.85 37.78,50.48 42.5,50.47 XTAL1.1
XTAL2
  Top 0.305: U1.7 28.65,39.77 31.36,42.48 36.13,42.48 C1.2
  Top 0.61: C1.2 38.29,43.5 XTAL1.2

### Text on the board
bRestrict: LED Controller | by RouNdeL
_tplace: J10 | J9 | © 2017 Krzysztof Zdulski